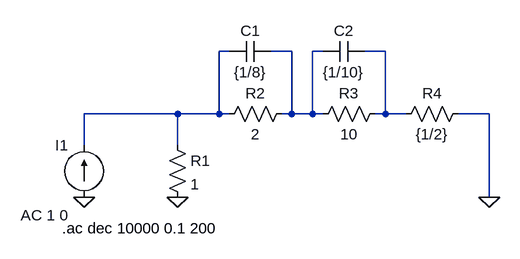
[diagram p0: schematic ej1.asc]
ej1.asc, the LTspice schematic file:
Version 4
SHEET 1 880 680
WIRE 208 -16 192 -16
WIRE 304 -16 272 -16
WIRE 352 -16 336 -16
WIRE 448 -16 416 -16
WIRE 128 80 -16 80
WIRE 192 80 192 -16
WIRE 192 80 128 80
WIRE 208 80 192 80
WIRE 304 80 304 -16
WIRE 304 80 288 80
WIRE 336 80 336 -16
WIRE 336 80 304 80
WIRE 352 80 336 80
WIRE 448 80 448 -16
WIRE 448 80 432 80
WIRE 480 80 448 80
WIRE 608 80 560 80
WIRE -16 128 -16 80
WIRE 128 128 128 80
WIRE 608 208 608 80
FLAG -16 208 0
FLAG 128 208 0
FLAG 608 208 0
SYMBOL res 112 112 R0
SYMATTR InstName R1
SYMATTR Value 1
SYMBOL res 304 64 R90
WINDOW 0 0 56 VBottom 2
WINDOW 3 32 56 VTop 2
SYMATTR InstName R2
SYMATTR Value 2
SYMBOL res 448 64 R90
WINDOW 0 0 56 VBottom 2
WINDOW 3 32 56 VTop 2
SYMATTR InstName R3
SYMATTR Value 10
SYMBOL res 576 64 R90
WINDOW 0 0 56 VBottom 2
WINDOW 3 32 56 VTop 2
SYMATTR InstName R4
SYMATTR Value {1/2}
SYMBOL cap 272 -32 R90
WINDOW 0 0 32 VBottom 2
WINDOW 3 32 32 VTop 2
SYMATTR InstName C1
SYMATTR Value {1/8}
SYMBOL cap 416 -32 R90
WINDOW 0 0 32 VBottom 2
WINDOW 3 32 32 VTop 2
SYMATTR InstName C2
SYMATTR Value {1/10}
SYMBOL current -16 208 R180
WINDOW 0 24 80 Left 2
WINDOW 3 24 0 Left 2
WINDOW 123 24 -28 Left 2
WINDOW 39 0 0 Left 0
SYMATTR InstName I1
SYMATTR Value ""
SYMATTR Value2 AC 1 0
TEXT -50 256 Left 2 !.ac dec 10000 0.1 200

The netlist it stands for:
* ej1.asc
R1 N001 0 1
R2 N002 N001 2
R3 N003 N002 10
R4 0 N003 {1/2}
C1 N002 N001 {1/8}
C2 N003 N002 {1/10}
I1 0 N001 AC 1 0
.ac dec 10000 0.1 200
.backanno
.end